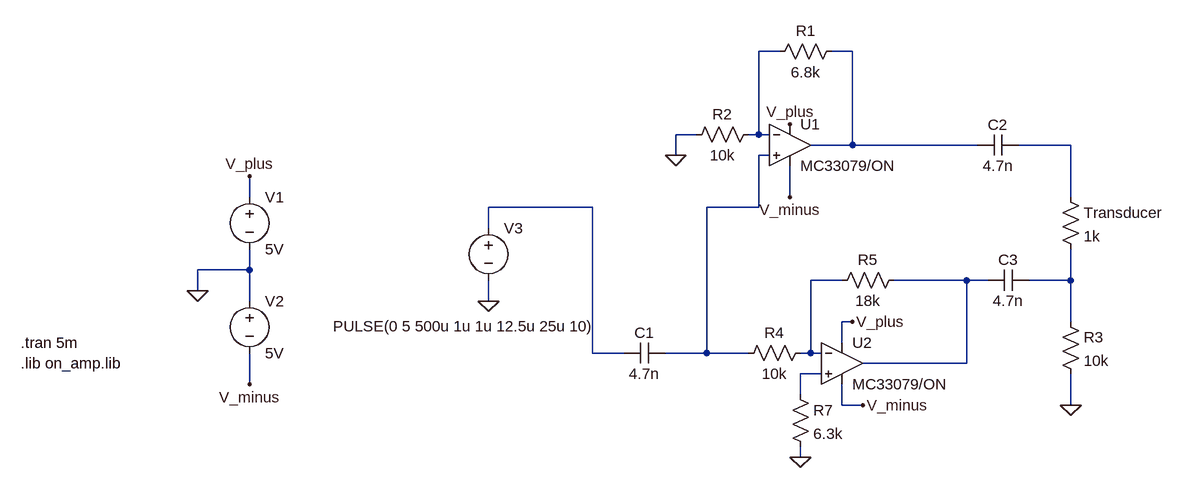
[diagram p0: schematic opamp_send_v03.asc]
opamp_send_v03.asc, the LTspice schematic file:
Version 4
SHEET 1 880 680
WIRE 176 -144 144 -144
WIRE 288 -144 256 -144
WIRE 48 -16 16 -16
WIRE 144 -16 144 -144
WIRE 144 -16 128 -16
WIRE 160 -16 144 -16
WIRE 288 0 288 -144
WIRE 288 0 224 0
WIRE 480 0 288 0
WIRE 624 0 544 0
WIRE 16 16 16 -16
WIRE 160 16 144 16
WIRE -640 80 -640 48
WIRE 192 80 192 32
WIRE 624 80 624 0
WIRE -112 96 -272 96
WIRE 144 96 144 16
WIRE 144 96 64 96
WIRE -272 128 -272 96
WIRE -640 192 -640 160
WIRE -640 192 -720 192
WIRE 272 208 224 208
WIRE 464 208 352 208
WIRE 496 208 464 208
WIRE 624 208 624 160
WIRE 624 208 560 208
WIRE -720 224 -720 192
WIRE -640 240 -640 192
WIRE -272 240 -272 208
WIRE 288 272 272 272
WIRE 624 272 624 208
WIRE 272 304 272 272
WIRE -112 320 -112 96
WIRE -64 320 -112 320
WIRE 64 320 64 96
WIRE 64 320 0 320
WIRE 128 320 64 320
WIRE 224 320 224 208
WIRE 224 320 208 320
WIRE 240 320 224 320
WIRE 464 336 464 208
WIRE 464 336 304 336
WIRE 240 352 208 352
WIRE -640 368 -640 320
WIRE 208 384 208 352
WIRE 272 400 272 368
WIRE 304 400 272 400
WIRE 624 400 624 352
WIRE 208 480 208 464
FLAG -720 224 0
FLAG -640 48 V_plus
FLAG -640 368 V_minus
FLAG 304 400 V_minus
FLAG 192 80 V_minus
FLAG 192 -32 V_plus
FLAG 288 272 V_plus
FLAG -272 240 0
FLAG 16 16 0
FLAG 208 480 0
FLAG 624 400 0
SYMBOL Opamps\\opamp2 192 -64 R0
SYMATTR InstName U1
SYMATTR Value MC33079/ON
SYMBOL Opamps\\opamp2 272 272 R0
SYMATTR InstName U2
SYMATTR Value MC33079/ON
SYMBOL voltage -640 64 R0
WINDOW 123 0 0 Left 0
WINDOW 39 0 0 Left 0
SYMATTR InstName V1
SYMATTR Value 5V
SYMBOL voltage -640 224 R0
WINDOW 123 0 0 Left 0
WINDOW 39 0 0 Left 0
SYMATTR InstName V2
SYMATTR Value 5V
SYMBOL voltage -272 112 R0
WINDOW 123 0 0 Left 0
WINDOW 39 0 0 Left 0
WINDOW 3 -239 167 Left 0
SYMATTR Value PULSE(0 5 500u 1u 1u 12.5u 25u 10)
SYMATTR InstName V3
SYMBOL res 608 64 R0
SYMATTR InstName Transducer
SYMATTR Value 1k
SYMBOL cap 0 304 R90
WINDOW 0 0 32 VBottom 0
WINDOW 3 32 32 VTop 0
SYMATTR InstName C1
SYMATTR Value 4.7n
SYMBOL res 272 -160 R90
WINDOW 0 0 56 VBottom 0
WINDOW 3 32 56 VTop 0
SYMATTR InstName R1
SYMATTR Value 6.8k
SYMBOL res 144 -32 R90
WINDOW 0 0 56 VBottom 0
WINDOW 3 32 56 VTop 0
SYMATTR InstName R2
SYMATTR Value 10k
SYMBOL res 224 304 R90
WINDOW 0 0 56 VBottom 0
WINDOW 3 32 56 VTop 0
SYMATTR InstName R4
SYMATTR Value 10k
SYMBOL res 368 192 R90
WINDOW 0 0 56 VBottom 0
WINDOW 3 32 56 VTop 0
SYMATTR InstName R5
SYMATTR Value 18k
SYMBOL cap 544 -16 R90
WINDOW 0 0 32 VBottom 0
WINDOW 3 32 32 VTop 0
SYMATTR InstName C2
SYMATTR Value 4.7n
SYMBOL cap 560 192 R90
WINDOW 0 0 32 VBottom 0
WINDOW 3 32 32 VTop 0
SYMATTR InstName C3
SYMATTR Value 4.7n
SYMBOL res 608 256 R0
SYMATTR InstName R3
SYMATTR Value 10k
SYMBOL res 192 368 R0
SYMATTR InstName R7
SYMATTR Value 6.3k
TEXT -992 336 Left 0 !.lib on_amp.lib
TEXT -992 304 Left 0 !.tran 5m

The netlist it stands for:
* opamp_send_v03.asc
XU1 N004 N001 V_plus V_minus N002 MC33079/ON  ; pins In+ In- V+ V- OUT
XU2 N009 N006 V_plus V_minus N007 MC33079/ON  ; pins In+ In- V+ V- OUT
V1 V_plus 0 5V
V2 0 V_minus 5V
V3 N005 0 PULSE(0 5 500u 1u 1u 12.5u 25u 10)
R§Transducer N003 N008 1k
C1 N004 N005 4.7n
R1 N002 N001 6.8k
R2 N001 0 10k
R4 N006 N004 10k
R5 N007 N006 18k
C2 N003 N002 4.7n
C3 N008 N007 4.7n
R3 N008 0 10k
R7 N009 0 6.3k
.lib on_amp.lib
.tran 5m
.backanno
.end